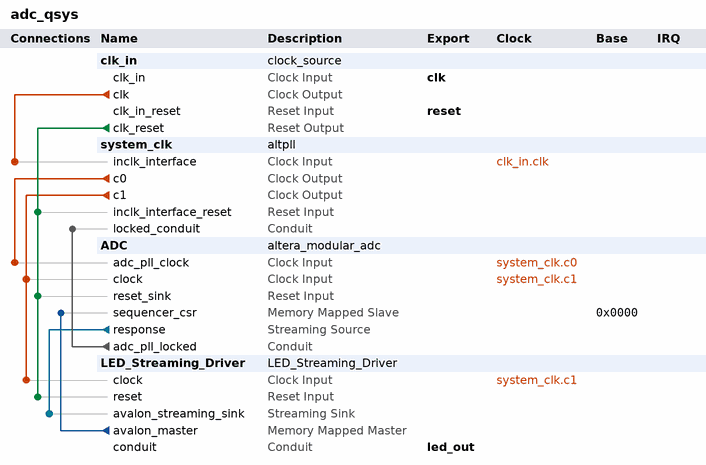
[diagram p0: system contents]
# Platform Designer (Qsys) system adc_qsys, MAX 10 10M50DAF484C6GES
# Parameters at their usual value, and those the tool derives, are not listed.
package require -exact qsys 15.0
create_system adc_qsys
set_project_property DEVICE_FAMILY {MAX 10}
set_project_property DEVICE 10M50DAF484C6GES

add_instance clk_in clock_source 15.0
set_instance_parameter_value clk_in clockFrequency 50000000

add_instance system_clk altpll 15.0
set_instance_parameter_value system_clk CLK0_DIVIDE_BY 5
set_instance_parameter_value system_clk CLK0_MULTIPLY_BY 1
set_instance_parameter_value system_clk CLK1_DIVIDE_BY 1
set_instance_parameter_value system_clk CLK1_DUTY_CYCLE 50
set_instance_parameter_value system_clk CLK1_MULTIPLY_BY 1
set_instance_parameter_value system_clk CLK1_PHASE_SHIFT 0
set_instance_parameter_value system_clk INCLK0_INPUT_FREQUENCY 20000
set_instance_parameter_value system_clk PORT_ARESET PORT_UNUSED
set_instance_parameter_value system_clk PORT_LOCKED PORT_USED
set_instance_parameter_value system_clk PORT_clk1 PORT_USED
set_instance_parameter_value system_clk PORT_clk2 PORT_UNUSED
set_instance_parameter_value system_clk PORT_clk3 PORT_UNUSED

add_instance ADC altera_modular_adc 15.0
set_instance_parameter_value ADC CLOCK_FREQ 50000000
set_instance_parameter_value ADC CORE_VAR 2
set_instance_parameter_value ADC DEVICE_PART 10M50DAF484C6GES
set_instance_parameter_value ADC ENABLE_DEBUG 1
set_instance_parameter_value ADC clkdiv 2
set_instance_parameter_value ADC int_vref_vr 3.0
set_instance_parameter_value ADC ip_is_for_which_adc 2
set_instance_parameter_value ADC refsel 0
set_instance_parameter_value ADC seq_order_length 4
set_instance_parameter_value ADC seq_order_slot_1 0
set_instance_parameter_value ADC seq_order_slot_2 5
set_instance_parameter_value ADC seq_order_slot_3 1
set_instance_parameter_value ADC seq_order_slot_4 5
set_instance_parameter_value ADC seq_order_slot_5 30
set_instance_parameter_value ADC seq_order_slot_6 30
set_instance_parameter_value ADC seq_order_slot_7 30
set_instance_parameter_value ADC tsclkdiv 1
set_instance_parameter_value ADC use_ch0 true
set_instance_parameter_value ADC use_ch2 false
set_instance_parameter_value ADC use_ch3 false
set_instance_parameter_value ADC use_ch4 false
set_instance_parameter_value ADC use_ch5 true
set_instance_parameter_value ADC use_ch6 false
set_instance_parameter_value ADC use_ch7 false
set_instance_parameter_value ADC use_ch8 false
set_instance_parameter_value ADC use_tsd false

add_instance LED_Streaming_Driver LED_Streaming_Driver 1.0

# connections
add_connection clk_in.clk system_clk.inclk_interface clock
add_connection system_clk.c0 ADC.adc_pll_clock clock
add_connection system_clk.c1 ADC.clock clock
add_connection system_clk.c1 LED_Streaming_Driver.clock clock
add_connection clk_in.clk_reset ADC.reset_sink reset
add_connection clk_in.clk_reset LED_Streaming_Driver.reset reset
add_connection clk_in.clk_reset system_clk.inclk_interface_reset reset
add_connection LED_Streaming_Driver.avalon_master ADC.sequencer_csr avalon
set_connection_parameter_value LED_Streaming_Driver.avalon_master/ADC.sequencer_csr baseAddress 0x0000
add_connection ADC.response LED_Streaming_Driver.avalon_streaming_sink avalon_streaming
add_connection ADC.adc_pll_locked system_clk.locked_conduit conduit

# exported interfaces
add_interface clk clock sink
set_interface_property clk EXPORT_OF clk_in.clk_in
add_interface led_out conduit end
set_interface_property led_out EXPORT_OF LED_Streaming_Driver.conduit
add_interface reset reset sink
set_interface_property reset EXPORT_OF clk_in.clk_in_reset

set_interconnect_requirement {$system} qsys_mm.clockCrossingAdapter HANDSHAKE
set_interconnect_requirement {$system} qsys_mm.enableEccProtection FALSE
set_interconnect_requirement {$system} qsys_mm.insertDefaultSlave FALSE
set_interconnect_requirement {$system} qsys_mm.maxAdditionalLatency 1

save_system adc_qsys.qsys
